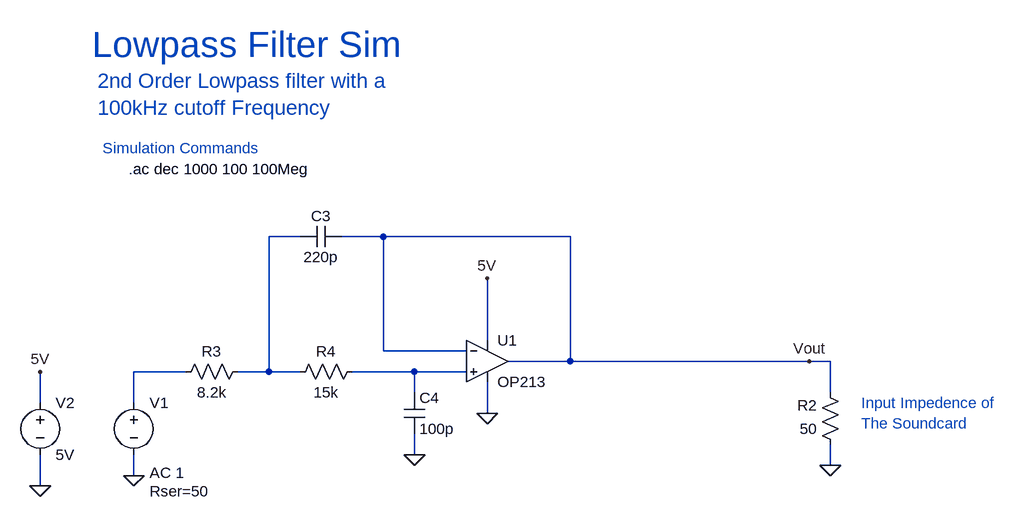
[diagram p0: schematic LowpassFilter.asc]
LowpassFilter.asc, the LTspice schematic file:
Version 4
SHEET 1 880 680
WIRE -576 -240 -624 -240
WIRE -448 -240 -512 -240
WIRE -160 -240 -448 -240
WIRE -288 -80 -288 -176
WIRE -448 -64 -448 -240
WIRE -320 -64 -448 -64
WIRE -160 -48 -160 -240
WIRE -160 -48 -256 -48
WIRE 208 -48 -160 -48
WIRE 240 -48 208 -48
WIRE -752 -32 -832 -32
WIRE -624 -32 -624 -240
WIRE -624 -32 -672 -32
WIRE -576 -32 -624 -32
WIRE -400 -32 -496 -32
WIRE -320 -32 -400 -32
WIRE -400 0 -400 -32
WIRE 240 0 240 -48
WIRE -976 16 -976 -32
WIRE -832 16 -832 -32
WIRE -288 32 -288 -16
WIRE -400 96 -400 64
WIRE 240 112 240 80
WIRE -832 128 -832 96
WIRE -976 144 -976 96
FLAG 240 112 0
FLAG -288 32 0
FLAG -288 -176 5V
FLAG -400 96 0
FLAG -832 128 0
FLAG -976 -32 5V
FLAG -976 144 0
FLAG 208 -48 Vout
SYMBOL res 256 96 R180
WINDOW 0 36 76 Left 2
WINDOW 3 36 40 Left 2
SYMATTR InstName R2
SYMATTR Value 50
SYMBOL Opamps\\OP213 -288 -112 R0
SYMATTR InstName U1
SYMBOL res -656 -48 R90
WINDOW 0 0 56 VBottom 2
WINDOW 3 32 56 VTop 2
SYMATTR InstName R3
SYMATTR Value 8.2k
SYMBOL res -480 -48 R90
WINDOW 0 0 56 VBottom 2
WINDOW 3 32 56 VTop 2
SYMATTR InstName R4
SYMATTR Value 15k
SYMBOL cap -512 -256 R90
WINDOW 0 0 32 VBottom 2
WINDOW 3 32 32 VTop 2
SYMATTR InstName C3
SYMATTR Value 220p
SYMBOL cap -416 0 R0
SYMATTR InstName C4
SYMATTR Value 100p
SYMBOL voltage -832 0 R0
WINDOW 123 24 124 Left 2
WINDOW 39 24 152 Left 2
SYMATTR InstName V1
SYMATTR Value ""
SYMATTR Value2 AC 1
SYMATTR SpiceLine Rser=50
SYMBOL voltage -976 0 R0
WINDOW 123 0 0 Left 0
WINDOW 39 0 0 Left 0
SYMATTR InstName V2
SYMATTR Value 5V
TEXT 288 16 Left 2 ;Input Impedence of\nThe Soundcard
TEXT -840 -344 Left 2 !.ac dec 1000 100 100Meg
TEXT -880 -376 Left 2 ;Simulation Commands
TEXT -896 -536 Left 5 ;Lowpass Filter Sim
TEXT -888 -480 Left 3 ;2nd Order Lowpass filter with a \n100kHz cutoff Frequency

The netlist it stands for:
* LowpassFilter.asc
R2 0 Vout 50
XU1 N003 Vout 5V 0 Vout OP213  ; pins In+ In- V+ V- OUT
R3 N001 N002 8.2k
R4 N003 N001 15k
C3 Vout N001 220p
C4 N003 0 100p
V1 N002 0 AC 1 Rser=50
V2 5V 0 5V
* Input Impedence of
* The Soundcard
.ac dec 1000 100 100Meg
* Simulation Commands
* Lowpass Filter Sim
* 2nd Order Lowpass filter with a
* 100kHz cutoff Frequency
.backanno
.end